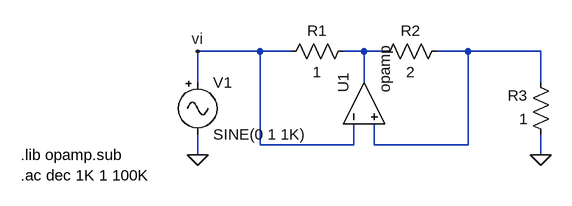
[diagram p0: schematic tp_1_6.asc]
tp_1_6.asc, the LTspice schematic file:
Version 4
SHEET 1 880 680
WIRE 272 304 176 304
WIRE 320 304 272 304
WIRE 432 304 400 304
WIRE 464 304 432 304
WIRE 592 304 544 304
WIRE 704 304 592 304
WIRE 176 352 176 304
WIRE 432 352 432 304
WIRE 704 352 704 304
WIRE 272 448 272 304
WIRE 416 448 416 416
WIRE 416 448 272 448
WIRE 448 448 448 416
WIRE 592 448 592 304
WIRE 592 448 448 448
WIRE 176 464 176 432
WIRE 704 464 704 432
FLAG 176 464 0
FLAG 704 464 0
FLAG 176 304 vi
SYMBOL res 416 288 R90
WINDOW 0 0 56 VBottom 2
WINDOW 3 32 56 VTop 2
SYMATTR InstName R1
SYMATTR Value 1
SYMBOL res 560 288 R90
WINDOW 0 0 56 VBottom 2
WINDOW 3 32 56 VTop 2
SYMATTR InstName R2
SYMATTR Value 2
SYMBOL res 720 448 R180
WINDOW 0 36 76 Left 2
WINDOW 3 36 40 Left 2
SYMATTR InstName R3
SYMATTR Value 1
SYMBOL Opamps/opamp 368 384 R270
SYMATTR InstName U1
SYMBOL Misc/signal 176 336 R0
SYMATTR InstName V1
SYMATTR Value2 AC 1
TEXT -96 464 Left 2 !.lib opamp.sub\n.ac dec 1K 1 100K

The netlist it stands for:
* tp_1_6.asc
R1 N001 vi 1
R2 N002 N001 2
R3 0 N002 1
XU1 vi N002 N001 opamp Aol=100K GBW=10Meg  ; pins invin noninvin out
V1 vi 0 SINE(0 1 1K) AC 1
.lib opamp.sub
.ac dec 1K 1 100K
.backanno
.end